# EAGLE design BT AQ DOL R8 (EAGLE 9.6.2)
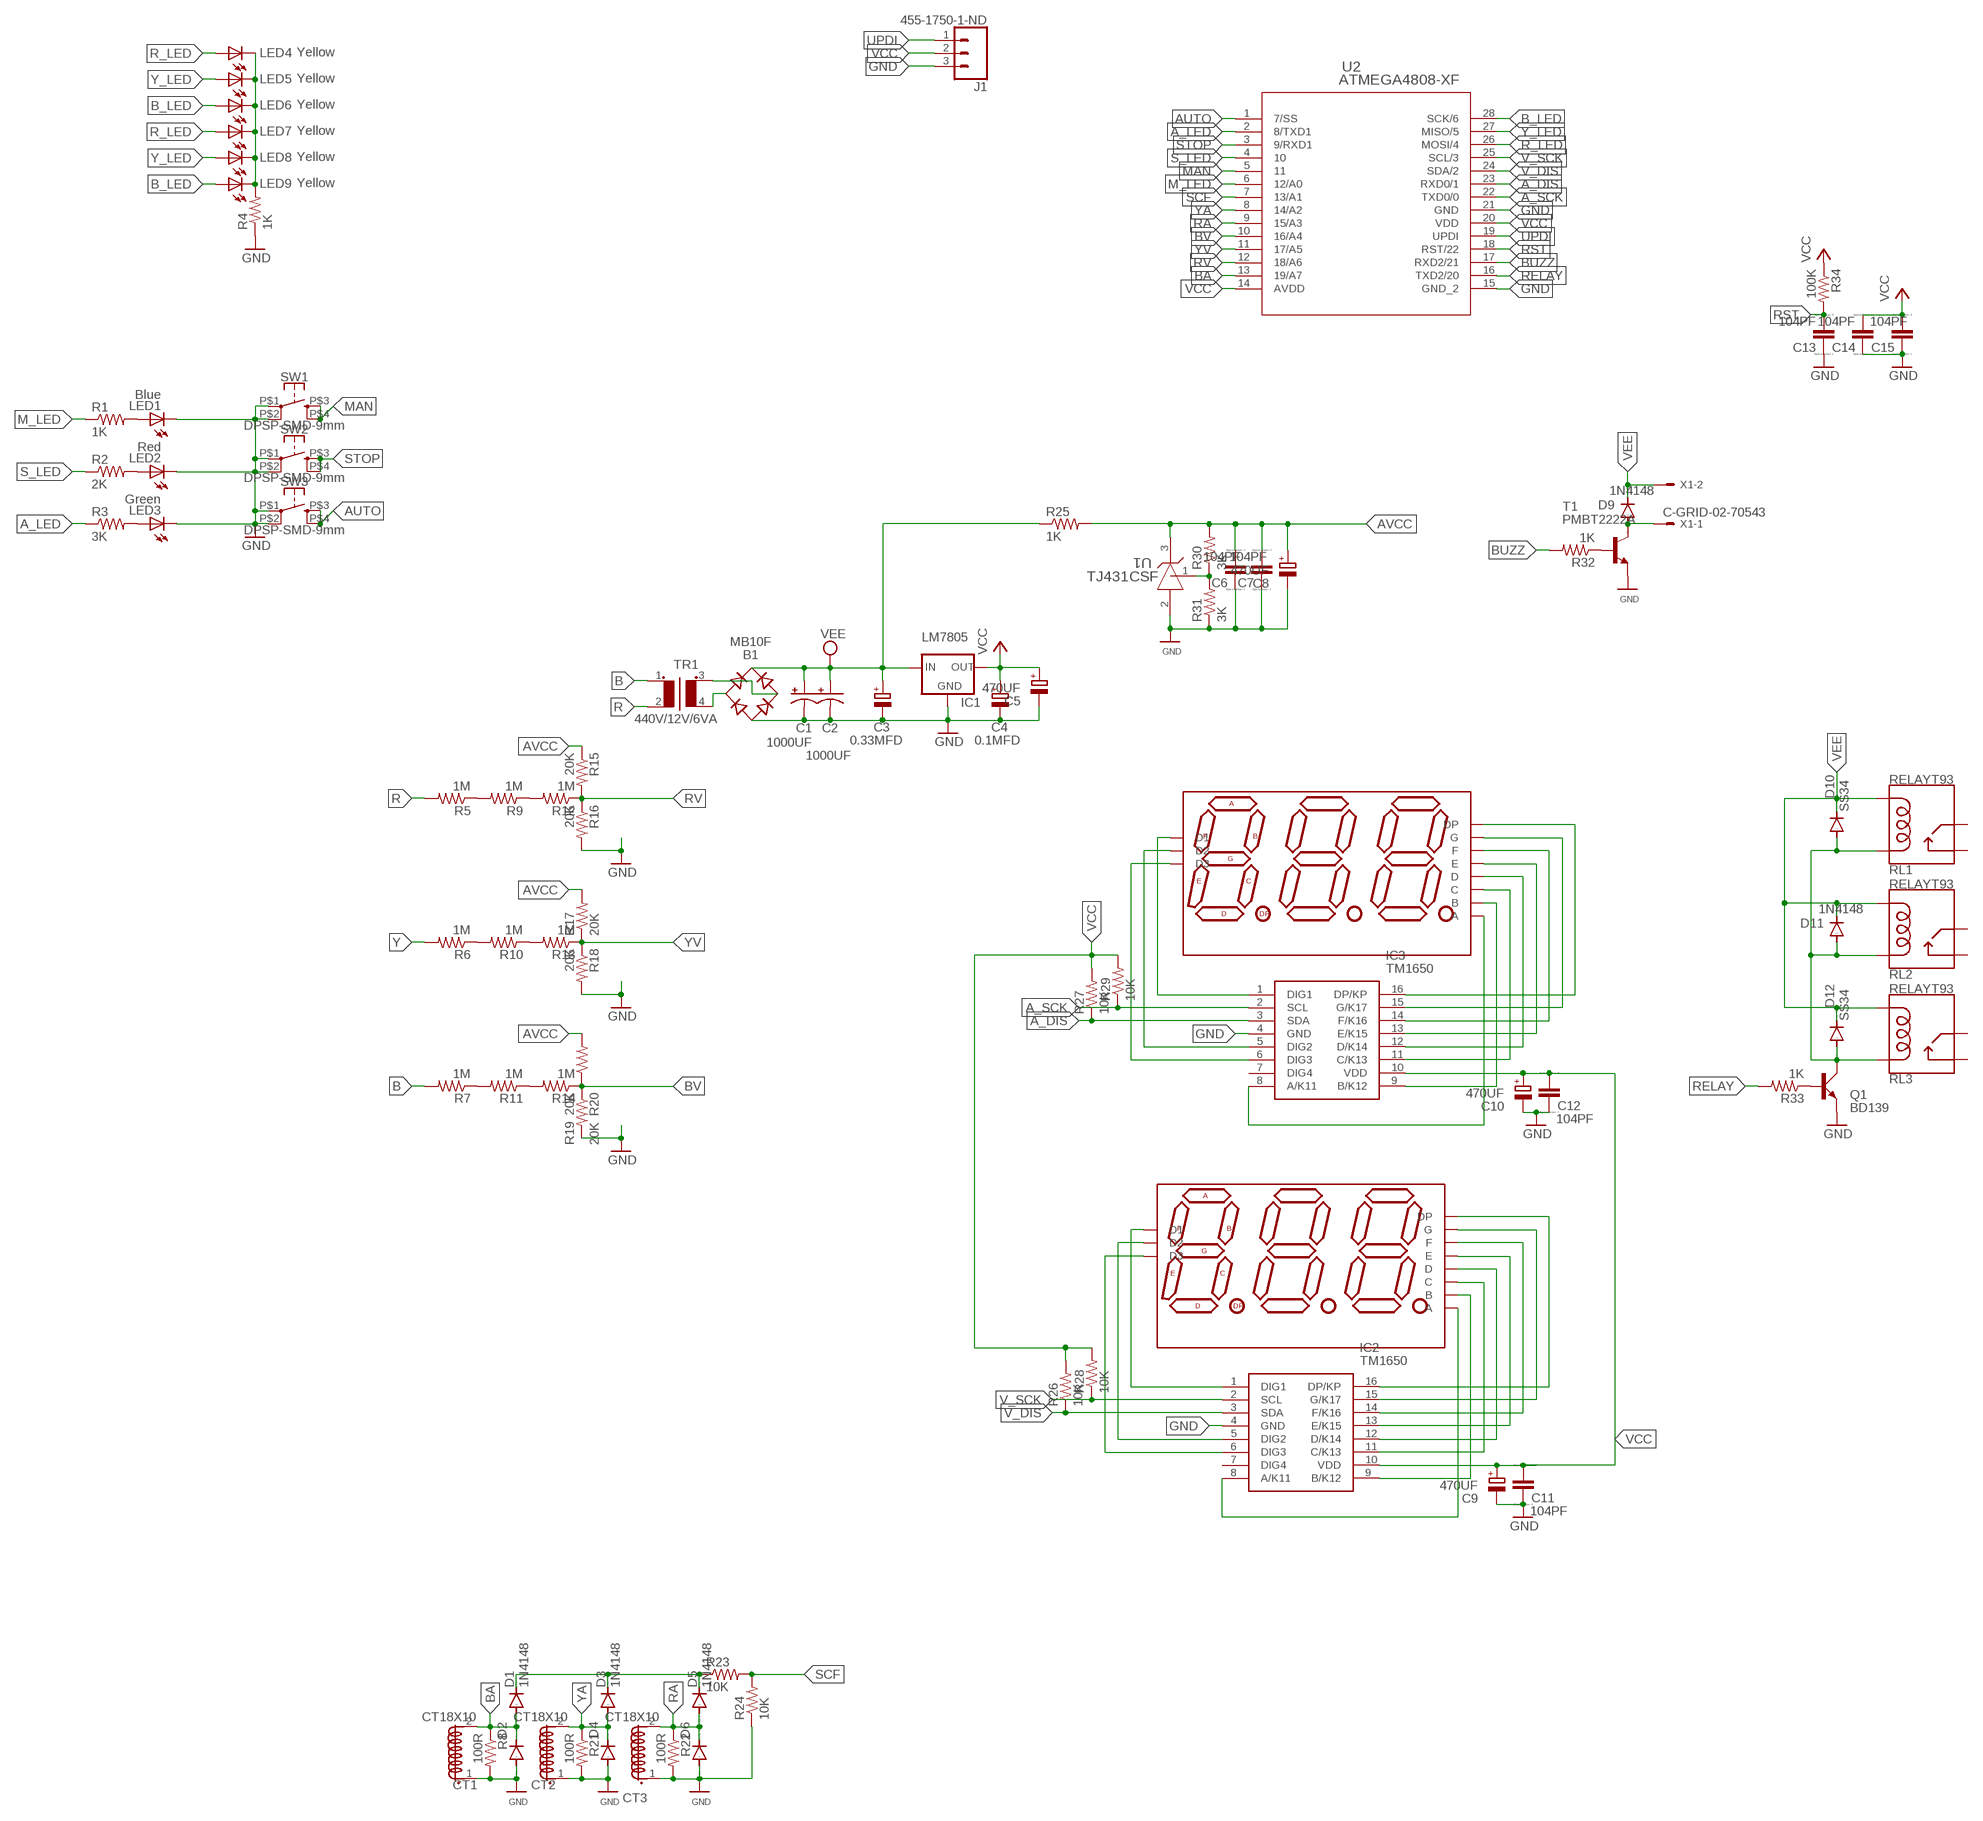
[diagram p0: schematic, sheet 1]

## Parts
B1  MB10F  MB8S  [SOIC-4]
C1  1000UF  CPOL-USE3.5-10  [E3,5-10]
C2  1000UF  CPOL-USE3.5-10  [E3,5-10]
C3  0.33MFD  CPOL-EUE2.5-5  [E2,5-5]
C4  0.1MFD  CPOL-EUE2.5-5  [E2,5-5]
C5  470UF  CPOL-EUE3.5-8  [E3,5-8]
C6  104PF  CC1206  [C1206]
C7  104PF  CC1206  [C1206]
C8  470UF  CPOL-EUE3.5-8  [E3,5-8]
C9  470UF  CPOL-EUE3.5-8  [E3,5-8]
C10  470UF  CPOL-EUE3.5-8  [E3,5-8]
C11  104PF  CC1206  [C1206]
C12  104PF  CC1206  [C1206]
C13  104PF  CC1206  [C1206]
C14  104PF  CC1206  [C1206]
C15  104PF  CC1206  [C1206]
CT1  CT18X10  [ZMCT103C]
CT2  CT18X10  [ZMCT103C]
CT3  CT18X10  [ZMCT103C]
D1  1N4148  DIODE-MINIMELF  [MINIMELF]
D2  SMAJ12A  DIODE-DO214AC  [DO214AC]
D3  1N4148  DIODE-MINIMELF  [MINIMELF]
D4  SMAJ12A  DIODE-DO214AC  [DO214AC]
D5  1N4148  DIODE-MINIMELF  [MINIMELF]
D6  SMAJ12A  DIODE-DO214AC  [DO214AC]
D7  SUNR036CC3D  7SEGMENT-3DIGITDIP  [7S3D036_DIP]
D8  SUNR036CC3D  7SEGMENT-3DIGITDIP  [7S3D036_DIP]
D9  1N4148  DIODE-MINIMELF  [MINIMELF]
D10  SS34  DIODE-DO-214AC  [DO-214AC]
D11  1N4148  DIODE-MINIMELF  [MINIMELF]
D12  SS34  DIODE-DO-214AC  [DO-214AC]
IC1  LM7805  78XXS  [78XXS]
IC2  TM1650  [SOIC127P604X185-16N]
IC3  TM1650  [SOIC127P604X185-16N]
J1  455-1750-1-ND  CONN_03  [1X03]
LED1  Blue  LED3MM  [LED3MM]
LED2  Red  LED3MM  [LED3MM]
LED3  Green  LED3MM  [LED3MM]
LED4  Yellow  LED3MM  [LED3MM]
LED5  Yellow  LED3MM  [LED3MM]
LED6  Yellow  LED3MM  [LED3MM]
LED7  Yellow  LED3MM  [LED3MM]
LED8  Yellow  LED3MM  [LED3MM]
LED9  Yellow  LED3MM  [LED3MM]
Q1  BD139  [TO126AV]
R1  1K  R-US_M1206  [M1206]
R2  2K  R-US_M1206  [M1206]
R3  3K  R-US_M1206  [M1206]
R4  1K  R-US_M1206  [M1206]
R5  1M  R-US_M1206  [M1206]
R6  1M  R-US_M1206  [M1206]
R7  1M  R-US_M1206  [M1206]
R8  100R  R-US_M1206  [M1206]
R9  1M  R-US_M1206  [M1206]
R10  1M  R-US_M1206  [M1206]
R11  1M  R-US_M1206  [M1206]
R12  1M  R-US_M1206  [M1206]
R13  1M  R-US_M1206  [M1206]
R14  1M  R-US_M1206  [M1206]
R15  20K  R-US_M1206  [M1206]
R16  20K  R-US_M1206  [M1206]
R17  20K  R-US_M1206  [M1206]
R18  20K  R-US_M1206  [M1206]
R19  20K  R-US_M1206  [M1206]
R20  20K  R-US_M1206  [M1206]
R21  100R  R-US_M1206  [M1206]
R22  100R  R-US_M1206  [M1206]
R23  10K  R-US_M1206  [M1206]
R24  10K  R-US_M1206  [M1206]
R25  1K  R-US_M1206  [M1206]
R26  10K  R-US_M1206  [M1206]
R27  10K  R-US_M1206  [M1206]
R28  10K  R-US_M1206  [M1206]
R29  10K  R-US_M1206  [M1206]
R30  3K  R-US_M1206  [M1206]
R31  3K  R-US_M1206  [M1206]
R32  1K  R-US_M1206  [M1206]
R33  1K  R-US_M1206  [M1206]
R34  100K  R-US_M1206  [M1206]
RL1  RELAYT93  [DT93]
RL2  RELAYT93  [DT93]
RL3  RELAYT93  [DT93]
SW1  DPSP-SMD-9mm  DPSP-SMD  [B3F-40XX-ROUND-SMD]
SW2  DPSP-SMD-9mm  DPSP-SMD  [B3F-40XX-ROUND-SMD]
SW3  DPSP-SMD-9mm  DPSP-SMD  [B3F-40XX-ROUND-SMD]
T1  PMBT2222A  MMUN2213LT1-NPN-SC59-BEC  [SC59-BEC]
TR1  440V/12V/6VA  TRANSFORMER6VA  [440V12V6VA]
U1  TJ431CSF  TJ431CSFDBZ0003A_L  [SOT-23]
U2  ATMEGA4808-XF  [SSOP28_SS_MCH]
X1  C-GRID-02-70543  [70543-02]

## Nets
A_DIS: IC3.3(SDA) R27.1 U2.23(RXD0/1)
A_LED: R3.1 U2.2(8/TXD1)
A_SCK: IC3.2(SCL) R29.1 U2.22(TXD0/0)
AUTO: SW3.P$3 SW3.P$4 U2.1(7/SS)
AVCC: C6.2 C7.2 C8.+ R15.1 R17.2 R19.2 R25.2 R30.2 U1.3(CATHODE)
B: R7.2 TR1.1
B_LED: LED6.A LED9.A U2.28(SCK/6)
BA: CT1.2(S1.2) D1.A D2.C R8.1 U2.13(19/A7)
BUZZ: R32.2 U2.17(RXD2/21)
BV: R14.1 R19.1 R20.1 U2.10(16/A4)
GND: B1.- C1.- C2.- C3.- C4.- C5.- C6.1 C7.1 C8.- C9.- C10.- C11.1 C12.1 C13.1 C14.1 C15.1 CT1.1(S1.1) CT2.1(S1.1) CT3.1(S1.1) D2.A D4.A D6.A IC1.GND IC2.4(GND) IC3.4(GND) J1.3 LED1.K(C) LED2.K(C) LED3.K(C) Q1.E R4.1 R8.2 R16.2 R18.2 R20.2 R21.2 R22.2 R24.1 R31.1 SW1.P$1 SW1.P$2 SW2.P$1 SW2.P$2 SW3.P$1 SW3.P$2 T1.E U1.2(ANODE) U2.15(GND_2) U2.21(GND)
M_LED: R1.1 U2.6(12/A0)
MAN: SW1.P$3 SW1.P$4 U2.5
N$1 [VEE]: B1.~2(AC2) TR1.3(S1)
N$2 [VEE]: B1.~1(AC1) TR1.4(S2)
N$3: D9.A T1.C X1.1
N$4: R32.1 T1.B
N$5: LED1.A R1.2
N$6: LED2.A R2.2
N$8: LED3.A R3.2
N$9: R30.1 R31.2 U1.1(REF)
N$10: LED4.K(C) LED5.K(C) LED6.K(C) LED7.K(C) LED8.K(C) LED9.K(C) R4.2
N$11: D1.C D3.C D5.C R23.1
N$13: R5.1 R9.2
N$14: R9.1 R12.2
N$15: R6.1 R10.2
N$18: R7.1 R11.2
N$19: R10.1 R13.2
N$22: Q1.B R33.1
N$23: R11.1 R14.2
N$28: D8.11(A) IC3.8(A/K11)
N$29: D8.7(B) IC3.9(B/K12)
N$30: D8.4(C) IC3.11(C/K13)
N$31: D8.2(D) IC3.12(D/K14)
N$32: D8.1(E) IC3.13(E/K15)
N$33: D8.10(F) IC3.14(F/K16)
N$34: D8.5(G) IC3.15(G/K17)
N$35: D8.3(DP) IC3.16(DP/KP)
N$36: D8.12(D1) IC3.1(DIG1)
N$37: D8.9(D2) IC3.5(DIG2)
N$38: D8.8(D3) IC3.6(DIG3)
N$39: D7.11(A) IC2.8(A/K11)
N$40: D7.7(B) IC2.9(B/K12)
N$41: D7.4(C) IC2.11(C/K13)
N$44: D7.2(D) IC2.12(D/K14)
N$48: D7.1(E) IC2.13(E/K15)
N$49: D7.10(F) IC2.14(F/K16)
N$50: D7.5(G) IC2.15(G/K17)
N$51: D7.3(DP) IC2.16(DP/KP)
N$52: D7.12(D1) IC2.1(DIG1)
N$53: D7.9(D2) IC2.5(DIG2)
N$54: D7.8(D3) IC2.6(DIG3)
N$121 [VEE]: D10.A D11.A D12.A Q1.C RL1.A1(COIL1) RL2.A1(COIL1) RL3.A1(COIL1)
R: R5.2 TR1.2
R_LED: LED4.A LED7.A U2.26(MOSI/4)
RA: CT3.2(S1.2) D5.A D6.C R22.1 U2.9(15/A3)
RELAY: R33.2 U2.16(TXD2/20)
RST: C13.2 R34.2 U2.18(RST/22)
RV: R12.1 R15.2 R16.1 U2.12(18/A6)
S_LED: R2.1 U2.4
SCF: R23.2 R24.2 U2.7(13/A1)
STOP: SW2.P$3 SW2.P$4 U2.3(9/RXD1)
UPDI: J1.1 U2.19(UPDI)
V_DIS: IC2.3(SDA) R26.1 U2.24(SDA/2)
V_SCK: IC2.2(SCL) R28.1 U2.25(SCL/3)
VCC: C4.+ C5.+ C9.+ C10.+ C11.2 C12.2 C14.2 C15.2 IC1.OUT IC2.10(VDD) IC3.10(VDD) J1.2 R26.2 R27.2 R28.2 R29.2 R34.1 U2.14(AVDD) U2.20(VDD)
VEE [VEE]: B1.+ C1.+ C2.+ C3.+ D9.C D10.C D11.C D12.C IC1.IN R25.1 RL1.A2(COIL2) RL2.A2(COIL2) RL3.A2(COIL2) X1.2
Y: R6.2
Y_LED: LED5.A LED8.A U2.27(MISO/5)
YA: CT2.2(S1.2) D3.A D4.C R21.1 U2.8(14/A2)
YV: R13.1 R17.1 R18.1 U2.11(17/A5)
Unconnected: IC2.7(DIG4) IC3.7(DIG4) RL1.11(MAIN) RL1.14(N0) RL2.11(MAIN) RL2.14(N0) RL3.11(MAIN) RL3.14(N0)

## Library data of the parts
B1 = rectifier:MB*S: Bridge Rectifier Source: http://www.fairchildsemi.com/ds/MB/MB6S.pdf
C1 C2 = rcl:CPOL-US: POLARIZED CAPACITOR, American symbol; SPICEPREFIX: C
C3-C5 C8-C10 = rcl:CPOL-EU: POLARIZED CAPACITOR, European symbol; SPICEPREFIX: C
C6 C7 C11-C15 = eagle-ltspice:C: CAPACITOR, European symbol; SPICEMODEL: NONE; SPICEPREFIX: C
CT1-CT3 = User Components:CT
D1-D6 D9-D12 = diode:DIODE-: DIODE
D7 D8 = User Components:7SEGMENT-3DIGIT
IC1 = v-reg:78XXS: VOLTAGE REGULATOR
IC2 IC3 = User Components:TM1650: The TM1650 is a dedicated LED (LED display) drive control circuit with a keyboard scan interface. The MCU input and output control digital interface, data latch, LED driver, keyboard scan, brightness adjustment and other circuits are integrated inside. The TM1650's stable performance, reliable quality, and high immunity to interference make it suitable for long-term continuous operation in 24 hours Source: Datasheet <http://www.titanmec.com/index.php/en/product/download/id/540.html>; DESCRIPTION: The TM1650 is a dedicated LED (LED display) drive control circuit with a keyboard scan interface. The MCU input and output control digital interface, data latch, LED driver, keyboard scan, brightness adjustment and other circuits are integrated inside. The TM1650's stable performance, reliable quality, and high immunity to interference make it suitable for long-term continuous operation in 24 hours; HEIGHT: 1.85mm; MANUFACTURER_NAME: TITAN MICRO ELECTRONICS; MANUFACTURER_PART_NUMBER: tm1650
J1 = SparkFun-Connectors:CONN_03: Multi connection point. Often used as Generic Header-pin footprint for 0.1 inch spaced/style header connections On any of the 0.1 inch spaced packages, you can populate with these: Break Away Headers - Straight <https://www.sparkfun.com/products/116> (PRT-00116) Break Away Male Headers - Right Angle <https://www.sparkfun.com/products/553> (PRT-00553) Female Headers <https://www.sparkfun.com/products/115> (PRT-00115) Break Away Headers - Machine Pin <https://www.sparkfun.com/products/117> (PRT-00117) Break Away Female Headers - Swiss Machine Pin <https://www.sparkfun.com/products/743> (PRT-00743) Stackable Header - 3 Pin (Female, 0.1") <https://www.sparkfun.com/products/13875> (PRT-13875) For SCREWTERMINALS and SPRING TERMINALS visit here: Screw Terimnals on SparkFun.com <https://www.sparkfun.com/search/results?term=Screw+Terminals> (5mm/3.5mm/2.54mm spacing) This device is also useful as a general connection point to wire up your design to another part of your project. Our various solder wires solder well into these plated through hole pads. Hook-Up Wire - Assortment (Stranded, 22 AWG) <https://www.sparkfun.com/products/11375> (PRT-11375) Hook-Up Wire - Assortment (Solid Core, 22 AWG) <https://www.sparkfun.com/products/11367> (PRT-11367) View the entire wire category on our website here <https://www.sparkfun.com/categories/141> Special notes: Molex polarized connector foot print use with SKU : PRT-08232 with associated crimp pins and housings.; PROD_ID: XXX-00000
LED1-LED9 = adafruit:LED: LED OSRAM: - CHIPLED LG R971, LG N971, LY N971, LG Q971, LY Q971, LO R971, LY R971 LH N974, LH R974 LS Q976, LO Q976, LY Q976 LO Q996 - Hyper CHIPLED LW Q18S LB Q993, LB Q99A, LB R99A - SideLED LS A670, LO A670, LY A670, LG A670, LP A670 LB A673, LV A673, LT A673, LW A673 LH A674 LY A675 LS A676, LA A676, LO A676, LY A676, LW A676 LS A679, LY A679, LG A679 - Hyper Micro SIDELED® LS Y876, LA Y876, LO Y876, LY Y876 LT Y87S - SmartLED LW L88C, LW L88S LB L89C, LB L89S, LG L890 LS L89K, LO L89K, LY L89K LS L896, LA L896, LO L896, LY L896 - TOPLED LS T670, LO T670, LY T670, LG T670, LP T670 LSG T670, LSP T670, LSY T670, LOP T670, LYG T670 LG T671, LOG T671, LSG T671 LB T673, LV T673, LT T673, LW T673 LH T674 LS T676, LA T676, LO T676, LY T676, LB T676, LH T676, LSB T676, LW T676 LB T67C, LV T67C, LT T67C, LS T67K, LO T67K, LY T67K, LW E67C LS E67B, LA E67B, LO E67B, LY E67B, LB E67C, LV E67C, LT E67C LW T67C LS T679, LY T679, LG T679 LS T770, LO T770, LY T770, LG T770, LP T770 LB T773, LV T773, LT T773, LW T773 LH T774 LS E675, LA E675, LY E675, LS T675 LS T776, LA T776, LO T776, LY T776, LB T776 LHGB T686 LT T68C, LB T68C - Hyper Mini TOPLED® LB M676 - Mini TOPLED Santana® LG M470 LS M47K, LO M47K, LY M47K Source: http://www.osram.convergy.de/
Q1 = transistor-power:BD139: NPN TRANSISTOR
R1-R7 R9-R20 R26-R29 R32-R34 = rcl:R-US_: RESISTOR, American symbol; SPICEPREFIX: R
R8 R21-R25 R30 R31 = rcl:R-US_: RESISTOR, American symbol
RL1-RL3 = User Components:RELAY
SW1-SW3 = User Components:DPSP-SMD
T1 = transistor:*-NPN-: NPN Transistror BF959 corrected 2008.03.06
TR1 = User Components:TRANSFORMER
U1 = User Components:TJ431CSF; COPYRIGHT: Copyright (C) 2022 Ultra Librarian. All rights reserved.; MANUFACTURER_PART_NUMBER: TL431IDBZTG4; MFR_NAME: Texas Instruments; REFDES: RefDes; TYPE: TYPE
U2 = User Components:ATMEGA4808-XF; COPYRIGHT: Copyright (C) 2022 Ultra Librarian. All rights reserved.; MANUFACTURER_PART_NUMBER: ATMEGA4808-XF; MFR_NAME: Microchip
X1 = con-molex:C-GRID-02: CONNECTOR wire to board 2.54 mm (0.100") pitch header; MF: MOLEX; OC_FARNELL: unknown; OC_NEWARK: unknown

## Net classes
0 default: width 0.254 mm, drill 0.508 mm, clearance 0.508 mm
1 VEE: width 0.762 mm, drill 0.508 mm, clearance 0.762 mm

## Board
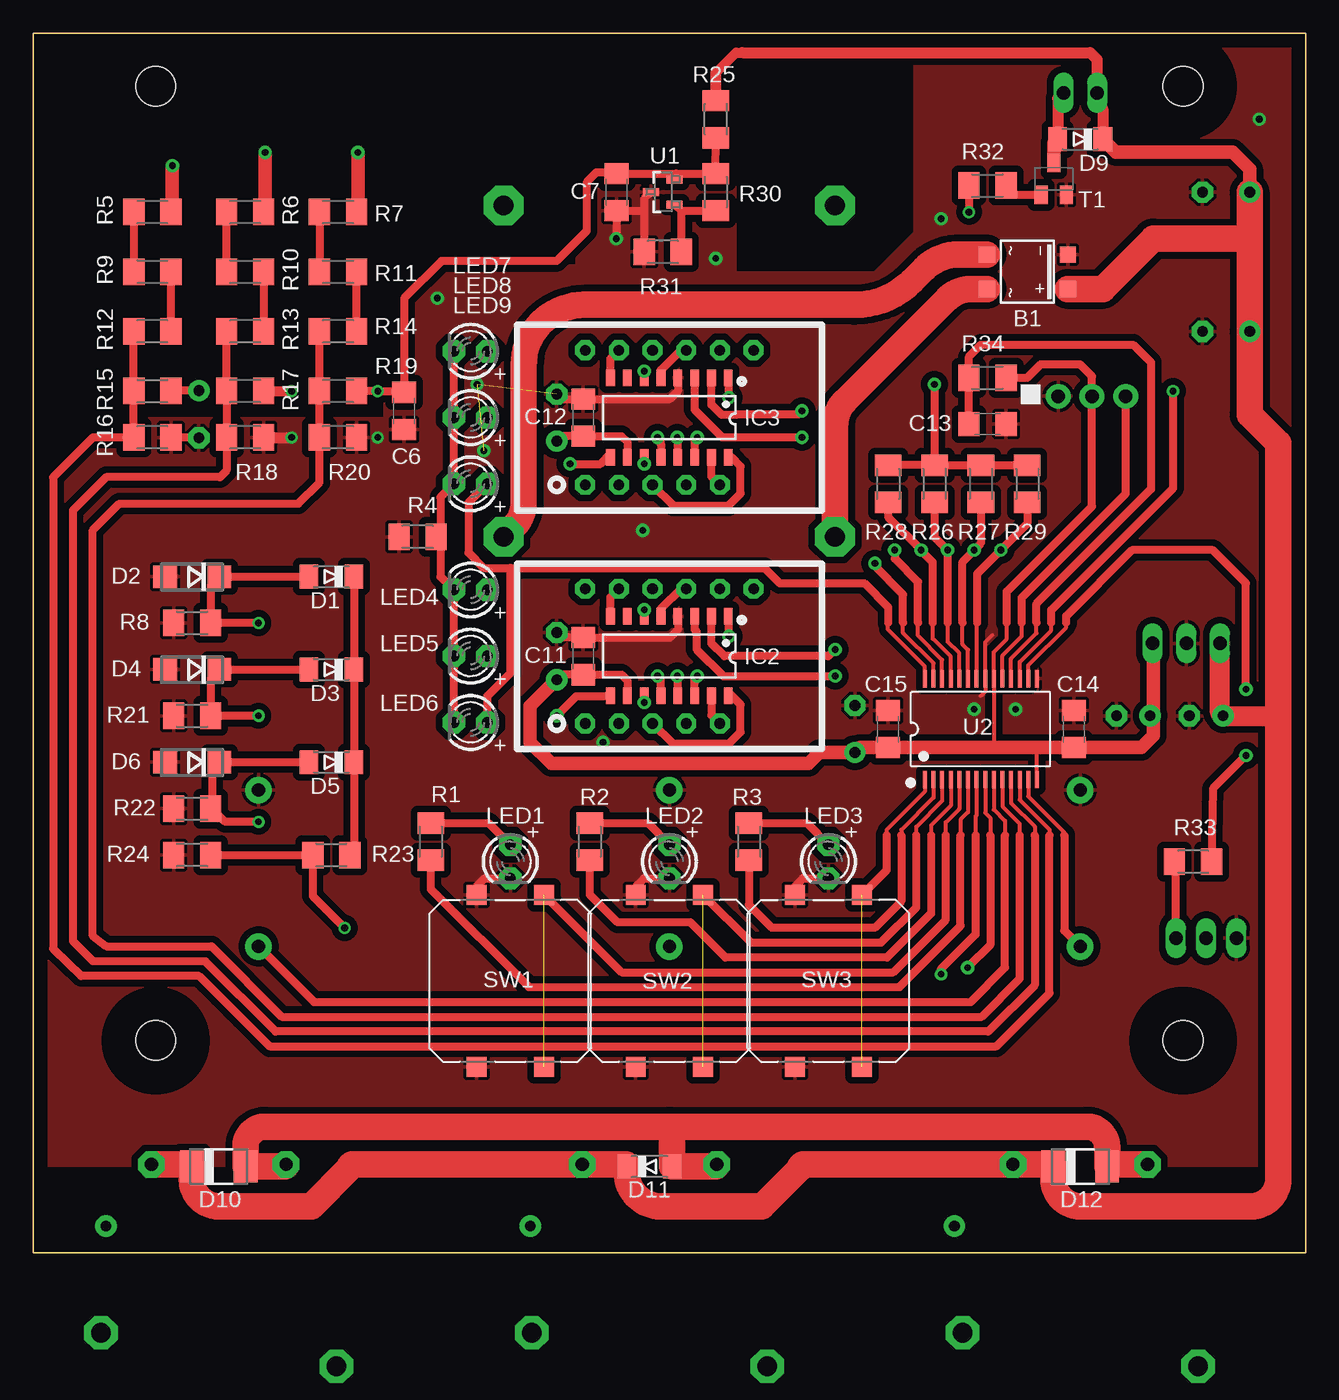
[diagram p1: board, top side]
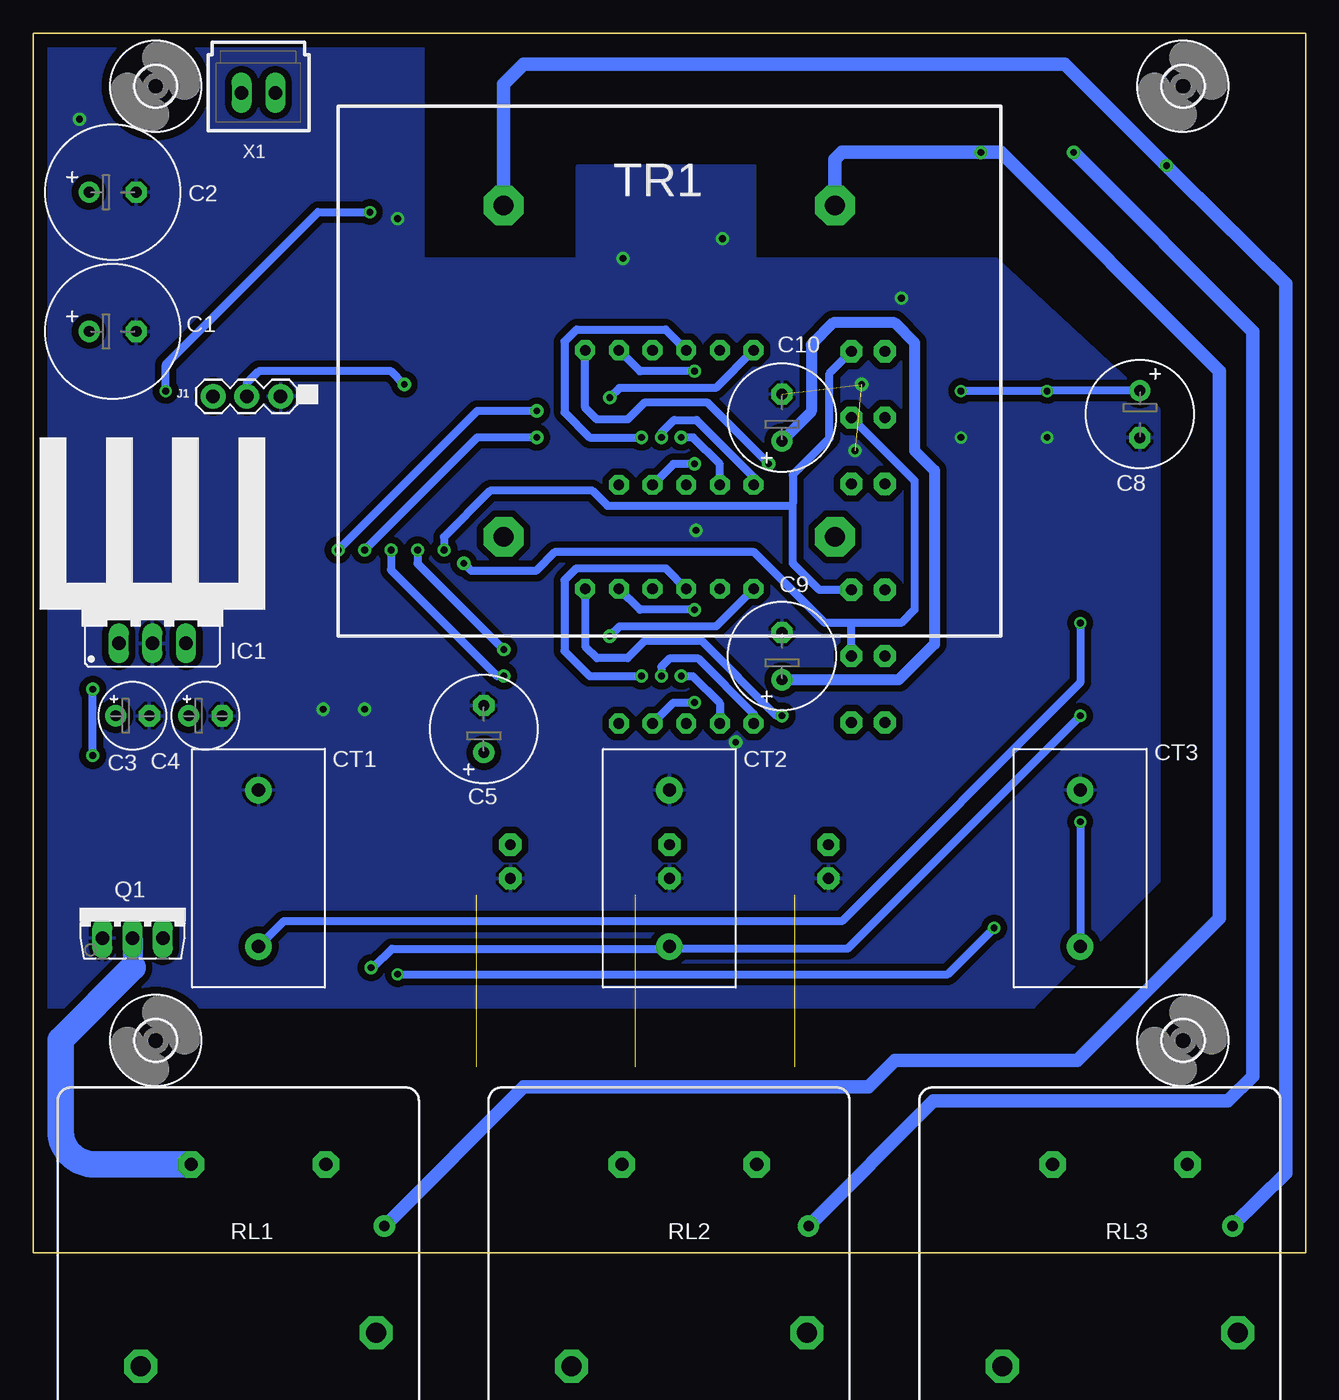
[diagram p2: board, bottom side, seen from below]

Size 96 x 92 mm. Coordinates in mm from the lower left corner, seen from the top.
Outline: 96,0 96,92 0,92 0,0 96,0
Copper layers (1*16): Top 0.035mm / dielectric 1.5mm / Bottom 0.035mm
Design rules "default *": minimum track width 6mil, minimum drill 0.35mm, track to track 6mil, track to pad 6mil, pad to pad 6mil, via to via 6mil, smd to smd 6mil, copper to edge 40mil, drill to drill 6mil, minimum pad ring 10mil, minimum via ring 8mil, stop-mask expansion 4mil, vias tented up to drill 20mil, thermal gap 10mil

### Footprints (pad centres in the part's own frame; a part is rotated, then mirrored left to right if it is on the bottom)
SOIC-4 = smd 1.2 x 1.2: + 1.3,3.05; - -1.3,3.05; ~1 -1.3,-3.05; ~2 1.3,-3.05
E3,5-10 = drill 0.813 pad 1.6: + -1.778,0 | drill 0.813 pad 1.6 octagon: - 1.778,0
E2,5-5 = drill 0.813 pad 1.6: + -1.27,0 | drill 0.813 pad 1.6 octagon: - 1.27,0
E3,5-8 = drill 0.813 pad 1.6: + -1.778,0 | drill 0.813 pad 1.6 octagon: - 1.778,0
C1206 = smd 1.6 x 1.8: 1 -1.4,0; 2 1.4,0
ZMCT103C = drill 1 pad 2: 1 -5.9,0; 2 5.9,0
MINIMELF = smd 1.4 x 1.8: A 1.7,0; C -1.7,0
DO214AC = smd 1.8 x 1.7: A 2.05,0; C -2.05,0
7S3D036_DIP = drill 0.8 pad 1.5 octagon: 1 -6.35,-5.08; 2 -3.81,-5.08; 3 -1.27,-5.08; 4 1.27,-5.08; 5 3.81,-5.08; 7 6.35,5.08; 8 3.81,5.08; 9 1.27,5.08; 10 -1.27,5.08; 11 -3.81,5.08; 12 -6.35,5.08
DO-214AC = smd 1.8 x 2.4: A 2.025,0; C -2.025,0
78XXS = drill 1.016 long: GND 0,-2.54; IN -2.54,-2.54; OUT 2.54,-2.54
SOIC127P604X185-16N = smd 1.25 x 0.65: 1 -3,4.445; 2 -3,3.175; 3 -3,1.905; 4 -3,0.635; 5 -3,-0.635; 6 -3,-1.905; 7 -3,-3.175; 8 -3,-4.445; 9 3,-4.445; 10 3,-3.175; 11 3,-1.905; 12 3,-0.635; 13 3,0.635; 14 3,1.905; 15 3,3.175; 16 3,4.445
1X03 = drill 1.016 pad 1.88: 1 0,0; 2 2.54,0; 3 5.08,0
LED3MM = drill 0.813 pad 1.676 octagon: A -1.27,0; K 1.27,0
TO126AV = drill 1.016 long: B 2.286,-1.27; C 0,-1.27; E -2.286,-1.27
M1206 = smd 1.6 x 2: 1 -1.4,0; 2 1.4,0
DT93 = drill 1.5 pad 2.5 octagon: 11 -2.54,-8.88; 14 -5.08,8.88 | drill 1 pad 2 octagon: A1 10.16,5.08; A2 10.16,-5.08
B3F-40XX-ROUND-SMD = smd 1.5 x 1.5: P$1 -6.5,2.54; P$2 6.5,2.54; P$3 -6.5,-2.54; P$4 6.5,-2.54
SC59-BEC = smd 1 x 1.4: B -0.95,-1.2; C 0,1.2; E 0.95,-1.2
440V12V6VA = drill 1.5 pad 3 octagon: 1 -12.5,12.5; 2 -12.5,-12.5; 3 12.5,-12.5; 4 12.5,12.5
SOT-23 = smd 0.6 x 1.2: 1 -0.95,-0.9; 2 0,0.9; 3 0.95,-0.9
SSOP28_SS_MCH = smd 1.3 x 0.3: 1 -3.8,4.225; 2 -3.8,3.575; 3 -3.8,2.925; 4 -3.8,2.275; 5 -3.8,1.625; 6 -3.8,0.975; 7 -3.8,0.325; 8 -3.8,-0.325; 9 -3.8,-0.975; 10 -3.8,-1.625; 11 -3.8,-2.275; 12 -3.8,-2.925; 13 -3.8,-3.575; 14 -3.8,-4.225; 15 3.8,-4.225; 16 3.8,-3.575; 17 3.8,-2.925; 18 3.8,-2.275; 19 3.8,-1.625; 20 3.8,-0.975; 21 3.8,-0.325; 22 3.8,0.325; 23 3.8,0.975; 24 3.8,1.625; 25 3.8,2.275; 26 3.8,2.925; 27 3.8,3.575; 28 3.8,4.225
3,0 = hole 3: 0,0
70543-02 = drill 1.016 long: 1 -1.27,0; 2 1.27,0

### Placement (x,y rotation side)
B1  75,74 270 top
C1  90,69.5 0 bottom
C2  90,80 0 bottom
C3  88.5,40.5 0 bottom
C4  83,40.5 0 bottom
C5  62,39.5 90 bottom
C6  28,63.5 90 top
C7  44,80 90 top
C8  12.5,63.25 270 bottom
C9  39.5,45 90 bottom
C10  39.5,63 90 bottom
C11  41.5,45 270 top
C12  41.5,63 270 top
C13  72,62.5 180 top
C14  78.5,39.5 270 top
C15  64.5,39.5 270 top
CT1  79,29 270 bottom
CT2  48,29 270 bottom
CT3  17,29 270 bottom
D1  22.5,51 180 top
D2  12,51 180 top
D3  22.5,44 180 top
D4  12,44 180 top
D5  22.5,37 180 top
D6  12,37 180 top
D7  48,45 0 top
D8  48,63 0 top
D9  79,84 180 top
D10  14,6.5 0 top
D11  46.5,6.5 0 top
D12  79,6.5 0 top
IC1  87,48.5 0 bottom
IC2  48,45 270 top
IC3  48,63 270 top
J1  82.42,64.6 0 bottom
LED1  36,29.5 270 top
LED2  48,29.5 270 top
LED3  60,29.5 270 top
LED4  33,50 180 top
LED5  33,45 180 top
LED6  33,40 180 top
LED7  33,68 180 top
LED8  33,63 180 top
LED9  33,58 180 top
Q1  88.5,25 0 bottom
R1  30,31 90 top
R2  42,31 90 top
R3  54,31 90 top
R4  29,54 0 top
R5  9,78.5 0 top
R6  16,78.5 0 top
R7  23,78.5 0 top
R8  12,47.5 180 top
R9  9,74 180 top
R10  16,74 180 top
R11  23,74 180 top
R12  9,69.5 0 top
R13  16,69.5 0 top
R14  23,69.5 0 top
R15  9,65 180 top
R16  9,61.5 0 top
R17  16,65 0 top
R18  16,61.5 0 top
R19  23,65 0 top
R20  23,61.5 0 top
R21  12,40.5 180 top
R22  12,33.5 180 top
R23  22.5,30 180 top
R24  12,30 0 top
R25  51.5,85.5 270 top
R26  68,58 90 top
R27  71.5,58 90 top
R28  64.5,58 90 top
R29  75,58 90 top
R30  51.5,80 90 top
R31  47.5,75.5 0 top
R32  72,80.5 180 top
R33  87.5,29.5 0 top
R34  72,66 180 top
RL1  79,-3.5 90 bottom
RL2  46.5,-3.5 90 bottom
RL3  14,-3.5 90 bottom
SW1  36,20.5 90 top
SW2  48,20.5 90 top
SW3  60,20.5 90 top
T1  77,81 0 top
TR1  48,66.5 270 bottom
U1  47.5,80 90 top
U2  71.5,39.5 90 top
U$1  [3,0]  86.75,16 0 bottom
U$2  [3,0]  9.25,16 0 bottom
U$3  [3,0]  86.75,88 0 bottom
U$4  [TO220_17X13]  87,55 0 bottom
U$8  [3,0]  9.25,88 0 bottom
X1  79,87.5 180 bottom

### Tracks (layer width: path | path; a pad name or v marks a point on that pad's centre or on a via)
A_DIS  (via drill 0.51 pad 1)
  Top 0.305: 70.11,47.5 70.11,45.88 70.53,45.47 U2.23
  Top 0.61: IC3.3 49.91,63.59 52,61.5 v58,61.5 | 70.11,47.5 70.11,52.11 v71,53 71.5,53.5 R27.1
  Bottom 0.61: v58,61.5 62.5,61.5 v71,53
A_LED
  Top 0.305: 65.5,31.5 65.5,31.9 67.92,34.32 U2.2
  Top 0.61: R3.1 54,26.24 55.74,24.5 63.5,24.5 65.5,26.5 65.5,31.5
A_SCK  (via drill 0.51 pad 1)
  Top 0.305: 71.22,47.5 71.17,47.45 U2.22
  Top 0.61: R29.1 75,55 v73,53 71.22,51.22 71.22,47.5 | v58,63.5 57.73,63.23 53.09,63.23 53.04,63.19 51.96,63.19 51.17,63.97 IC3.2
  Bottom 0.61: v58,63.5 62.5,63.5 v73,53
AUTO  (1 unrouted)
  Top 0.305: 64.38,31.5 64.38,31.88 67.28,34.77 U2.1
  Top 0.61: SW3.P$4 64.38,28.84 64.38,31.5
AVCC  (via drill 0.51)
  Top 0.61: 48.5,81.4 C7.2 43.9,81.5 42.5,81.5 41.75,80.75 41.75,77.06 39.5,74.81 30.81,74.81 28,72 C6.2 27.9,65 v26,65 R19.2 | 48.5,81.4 51.4,81.4 | 51.4,81.4 R30.2 | U1.3 48.5,81.05 48.5,81.4 | R25.2 51.4,81.4 | C8.+ 10.43,65.03 R15.1
  Top 0.762: R17.2 v19.5,65
  Bottom 0.61: C8.+ 19.47,65.03 v19.5,65 v26,65
B  (via drill 0.51 pad 1, 0.8 pad 1.6)
  Top 0.61: 24.5,78.6 R7.2
  Top 1: v24.5,83 24.5,78.6
  Bottom 1: v69.5,2 59,12.5 33,12.5 31,14.5 17.2,14.5 6.5,25.2 6.5,66.5 23,83 v24.5,83 35,83 35.5,82.5 TR1.1
B_LED
  Top 0.305: 64.52,47.5 64.5,47.48 64.5,47 67.28,44.23 U2.28
  Top 0.61: 64.52,47.5 64.52,48.68 62.7,50.5 56.31,50.5 55.16,51.65 36,51.65 | LED6.A 34.27,42 36,43.73 36,51.65 | LED9.A 32.85,56.58 32.85,52.8 34,51.65 36,51.65
BA  (via drill 0.51)
  Top 0.305: 77.79,31.5 77.79,31.7 75.08,34.41 U2.13
  Top 0.61: CT1.2 77.79,24.31 77.79,31.5 | D1.A D2.C 13.4,50.35 R8.1 v17,47.5
  Bottom 0.61: v17,47.5 17,43 35,25 77.1,25 CT1.2
BUZZ  (via drill 0.51)
  Top 0.305: 76.81,47.5 76.81,46.95 74.42,44.56 U2.17
  Top 0.61: 76.81,47.5 76.81,48.49 86,57.68 v86,65 | R32.2 v70.6,78.5
  Bottom 0.61: v86,65 86,67 74.5,78.5 v70.6,78.5
BV
  Top 0.305: 74.44,31.5 74.44,32.35 73.12,33.67 U2.10
  Top 0.61: R14.1 R19.1 R20.1 21.6,58.1 20,56.5 6.5,56.5 4.5,54.5 4.5,23.89 5.51,23.1 13.45,23.1 18.76,17.8 71.56,17.8 74.44,20.68 74.44,31.5
GND  (via drill 0.51, 0.51 pad 1)  (2 unrouted)
  Top 0.305: 72.34,46.57 71.83,46.05 U2.21 71.83,42.33 71.5,42
  Top 0.61: C10.- 39.88,64.4 C12.1 48.03,64.4 48.63,65 IC3.4 | 57.46,27.62 58.07,28.23 LED3.K | 45.46,27.62 46.07,28.23 LED2.K | 33.46,27.62 34.07,28.23 LED1.K | U1.2 46.1,79.5 46.1,78.5 | 46.1,78.5 R31.1 | 46.1,78.5 46,78.6 C7.1 v44,76.5 | IC2.4 48.63,47 48.03,46.4 C11.1 39.88,46.4 C9.- | 10.5,47 10.6,47.1 R8.2 | C8.- 10.43,61.47 R16.2
  Top 0.813: C14.1 78.4,41 | R18.2 v19.5,61.5
  other vias: 71,41 74.13,41 68.5,78 26,61.5 43,38.5 33.5,65.5 34,60.5 46,54.5 92.5,85.5 51.5,75 30.5,72
  pour Top: 96,6.5 0,6.5 0,63 26.5,63 26.5,74.5 41,74.5 41,86.5 53,86.5 53,74.02 63.46,73.96 66.5,77 66.5,92 96,92
  pour Bottom: 96,92 96,18.5 20.5,18.5 11,28 11,63.62 23.28,75 41.5,75 41.5,82 55,82 55,75 66.5,75 66.5,92
M_LED
  Top 0.305: 69.97,31.5 69.97,32.67 70.53,33.23 U2.6
  Top 0.61: R1.1 30,27.43 37.4,20.03 65.36,20.03 69.97,24.65 69.97,31.5
MAN  (1 unrouted)
  Top 0.305: 68.85,31.5 68.85,32.45 69.88,33.48 U2.5
  Top 0.61: SW1.P$4 44.39,21.15 64.89,21.15 68.85,25.11 68.85,31.5
N$1
  Top 2: B1.~2 70.75,72.7 arc45 68.96,71.96 61.24,64.24 arc45 60.5,62.45 TR1.3
N$2
  Top 2: B1.~1 69.82,75.3 arc45 67.23,74.23 66.31,73.31 arc-45 61.95,71.5 41.55,71.5 arc45 38.33,70.17 arc45 37,66.95 37,56.55 arc-45 36.26,54.76 TR1.4
N$3
  Top 0.813: X1.1 77.3,87.07 D9.A
  Top 1: T1.C 77,83.7 D9.A
N$4
  Top 0.61: R32.1 74.1,79.8 T1.B
N$5
  Top 0.61: R1.2 34.37,32.4 LED1.A
N$6
  Top 0.61: R2.2 46.37,32.4 LED2.A
N$8
  Top 0.61: R3.2 58.37,32.4 LED3.A
N$9
  Top 0.61: R31.2 48.9,78.55 | 48.9,78.55 U1.1 | R30.1 51.45,78.55 48.9,78.55
N$10
  Top 0.61: LED7.K LED8.K LED9.K 30.73,57 30.73,54 | 30.73,54 30.73,51 LED4.K LED5.K LED6.K | R4.2 30.73,54
N$11
  Top 0.61: D1.C D3.C D5.C 24.2,30.3 R23.1
N$13
  Top 0.61: R5.1 R9.2
N$14
  Top 0.61: R12.2 R9.1
N$15
  Top 0.61: R10.2 R6.1
N$18
  Top 0.61: R7.1 R11.2
N$19
  Top 0.61: R10.1 R13.2
N$22
  Top 0.61: R33.1 86.21,29.39 Q1.B
N$23
  Top 0.61: R14.2 R11.1
N$28
  Top 0.61: IC3.8 43.55,67.44 D8.11
N$29  (via drill 0.51 pad 1)
  Top 0.61: v40.5,59.5 42.79,59.5 43.55,60.27 IC3.9
  Bottom 0.61: D8.7 54.35,63.73 53.47,62.86 51.14,62.86 49.88,64.12 45.12,64.12 v40.5,59.5
N$30  (via drill 0.51 pad 1)
  Top 0.61: IC3.11 v46.1,59.5
  Bottom 0.61: v46.1,59.5 47.69,59.5 D8.4
N$31  (via drill 0.51 pad 1)
  Top 0.61: v47.1,61.5 47.36,61.14 47.36,61.03 47.37,61.02 IC3.12
  Bottom 0.61: D8.2 44.19,59.48 46.21,61.5 v47.1,61.5
N$32  (via drill 0.51 pad 1)
  Top 0.61: v48.6,61.5 48.63,61.37 IC3.13
  Bottom 0.61: D8.1 41.65,58.52 45.94,62.81 47.64,62.81 48.6,61.86 v48.6,61.5
N$33  (via drill 0.51 pad 1)
  Top 0.61: v50.1,61.5 49.91,61.41 IC3.14
  Bottom 0.61: v50.1,61.5 54.02,61.5 55.91,63.4 55.91,68.73 55,69.64 48.29,69.64 D8.10
N$34
  Top 0.61: D8.5 51.17,58.55 IC3.15
N$35
  Top 0.61: D8.3 48.29,56.36 52.46,56.36 53.37,57.27 53.37,59.34 52.71,60 IC3.16
N$36  (via drill 0.51 pad 1)
  Top 0.61: v52.5,64.5 52.45,64.56 52.45,65.73 IC3.1
  Bottom 0.61: v52.5,64.5 51.77,65.23 44.5,65.23 D8.12
N$37
  Top 0.61: D8.9 48.87,68.08 47.37,66.58 IC3.5
N$38  (via drill 0.51 pad 1)
  Top 0.61: IC3.6 v46.09,66.5 v46.1,66.5
  Bottom 0.61: v46.1,66.5 50.23,66.5 D8.8
N$39
  Top 0.61: IC2.8 43.55,49.45 D7.11
N$40  (via drill 0.51 pad 1)
  Top 0.61: v39.5,40.5 40.99,41.99 43.28,41.99 43.55,42.27 IC2.9
  Bottom 0.61: v39.5,40.5 39.92,40.5 45.55,46.13 49.87,46.13 51.14,44.86 53.47,44.86 54.35,45.73 D7.7
N$41  (via drill 0.51 pad 1)
  Top 0.61: IC2.11 46.09,41.59 v46.1,41.5
  Bottom 0.61: D7.4 47.69,41.5 v46.1,41.5
N$44  (via drill 0.51 pad 1)
  Top 0.61: IC2.12 47.37,43.23 v47.1,43.5
  Bottom 0.61: v47.1,43.5 46.24,43.5 44.19,41.45 D7.2
N$48  (via drill 0.51 pad 1)
  Top 0.61: IC2.13 48.63,43.37 v48.6,43.5
  Bottom 0.61: D7.1 41.65,40.65 45.81,44.81 48,44.81 48.6,44.21 v48.6,43.5
N$49  (via drill 0.51 pad 1)
  Top 0.61: v50.1,43.5 49.91,43.41 49.91,43 49.91,42.27 IC2.14
  Bottom 0.61: v50.1,43.5 54.02,43.5 55.91,45.4 55.91,50.73 55,51.64 48.29,51.64 D7.10
N$50
  Top 0.61: IC2.15 51.17,40.55 D7.5
N$51
  Top 0.61: D7.3 48.29,38.36 52.46,38.36 53.37,39.27 53.37,41.34 52.45,42.27 IC2.16
N$52  (via drill 0.51 pad 1)
  Top 0.61: v52.5,46.5 52.45,46.55 52.45,47.5 52.45,47.73 IC2.1
  Bottom 0.61: v52.5,46.5 51.75,47.25 44.48,47.25 D7.12
N$53
  Top 0.61: IC2.5 47.37,48.58 48.87,50.08 D7.9
N$54  (via drill 0.51 pad 1)
  Top 0.61: IC2.6 v46.09,48.49 v46.1,48.5
  Bottom 0.61: v46.1,48.5 50.23,48.5 D7.8
N$121
  Top 2: 48,9.5 17.5,9.5 arc90 16.02,8.03 D10.A 18.92,6.5 arc90 RL3.A1 | 48,9.5 79.48,9.5 arc-90 81.03,7.96 D12.A arc-90 81.19,6.66 RL1.A1 | RL2.A1 arc-90 51.42,6.5 D11.A 48.2,9.3 arc90 48,9.5
  Bottom 1.5: Q1.C 88.5,21.5
  Bottom 2: 88.5,21.5 93.93,16.07 93.93,9.2 arc-90 91.39,6.66 RL1.A1
R  (via drill 0.51 pad 1, 0.8 pad 1.6)
  Top 0.61: 10.5,78.6 R5.2
  Top 1: v10.5,82 10.5,78.6
  Bottom 1: v5.5,2 5.5,2.07 1.5,6 1.5,73.1 9.5,80.99 9.5,81 v10.5,82 18.15,89.65 59,89.65 60.5,88.15 TR1.2
R_LED  (via drill 0.51 pad 1)
  Top 0.305: 66.75,47.5 66.75,46.54 68.58,44.72 U2.26
  Top 0.61: v65,53 65,52.36 66.75,50.6 66.75,47.5
  Bottom 0.61: v65,53 65,54 61.52,57.48 53.8,57.48 52.68,56.36 38.82,56.36 38.68,56.5 | LED7.A 35.92,66.35 35.92,61.44 38.68,58.68 38.68,56.5 | 38.68,56.5 38.68,52 36.68,50 LED4.A
RA  (via drill 0.51)
  Top 0.305: 73.32,31.5 73.32,32.58 72.47,33.42 U2.9
  Top 0.61: 13.5,33.5 R22.1 | 73.32,31.5 73.32,21.5 70.74,18.92 21.18,18.92 CT3.2 | 13.5,33.5 13.5,36.45 D6.C D5.A | v17,32.5 14.5,32.5 13.5,33.5
  Bottom 0.61: v17,32.5 CT3.2
RELAY  (via drill 0.51 pad 1)
  Top 0.305: 77.93,47.5 77.93,47.17 75.13,44.37 75.08,44.31 U2.16
  Top 0.61: v91.5,37.5 89,35 R33.2 | 77.93,47.5 77.93,48.03 82.9,53 89,53 91.5,50.5 v91.5,42.5
  Bottom 0.61: v91.5,37.5 v91.5,42.5
RST
  Top 0.305: 75.69,47.5 75.69,46.73 73.78,44.81 U2.18
  Top 0.61: C13.2 R34.2 70.6,67.6 71.5,68.5 83,68.5 84.33,67.17 84.33,57.59 75.69,48.95 75.69,47.5
RV
  Top 0.305: 76.68,31.5 76.68,31.92 74.42,34.17 U2.12
  Top 0.61: R12.1 R15.2 R16.1 4.5,61.5 1.5,58.5 1.5,22.92 3.62,20.87 12.53,20.87 17.83,15.56 72.67,15.56 76.68,19.56 76.68,31.5
S_LED
  Top 0.305: 67.73,31.5 67.73,32.23 69.22,33.73 U2.4
  Top 0.61: R2.1 42,27 44.09,24.91 49.59,24.91 52.23,22.27 64.43,22.27 67.73,25.57 67.73,31.5
SCF  (via drill 0.51)
  Top 0.305: 71.09,31.5 71.09,32.91 71.17,33 U2.7
  Top 0.61: 71.09,31.5 71.09,24 68.5,21.41 v68.5,21 | v23.5,24.5 21.1,26.9 R23.2 R24.2
  Bottom 0.61: v68.5,21 27,21 v23.5,24.5
STOP  (1 unrouted)
  Top 0.305: 66.62,31.5 66.62,32.12 68.58,34.08 U2.3
  Top 0.61: SW2.P$4 54.15,23.39 63.97,23.39 66.62,26.04 66.62,31.5
UPDI
  Top 0.305: 74.58,47.5 74.58,46.51 73.12,45.06 U2.19
  Top 0.61: 74.58,47.5 74.58,49.42 82.42,57.26 J1.1
V_DIS  (via drill 0.51 pad 1)
  Top 0.305: 68.99,47.5 68.99,46.1 69.88,45.22 U2.24
  Top 0.61: IC2.3 49.91,47 50.06,46.85 50.06,45.51 52.06,43.5 v60.5,43.5 | R26.1 68,54 68.99,53.01 | 68.99,53.01 68.99,47.5 | v69,53 68.99,53.01
  Bottom 0.61: v69,53 69,51.5 61,43.5 v60.5,43.5
V_SCK  (via drill 0.51 pad 1)
  Top 0.305: 67.87,47.5 67.87,46.32 69.22,44.97 U2.25
  Top 0.61: v60.5,45.5 60,45 52.15,45 51.17,45.97 IC2.2 | R28.1 64.5,55.5 v67,53 67,52.94 67.87,52.07 67.87,47.5
  Bottom 0.61: v67,53 67,52 v60.5,45.5
VCC  (via drill 0.51 pad 1)
  Top 0.305: 73.46,47.5 73.46,46.29 72.47,45.31 U2.20 72.47,38.12 72.5,38.1 | U2.14 75.72,37.88
  Top 0.61: 73.46,47.5 73.46,49.88 79.88,56.3 J1.2 79.88,66.12 79,67 76,67 75,66 R34.1 | R26.2 R27.2 R29.2 | R26.2 R28.2 | IC2.10 44.83,43.17 44.4,43.6 C11.2 39.88,43.6 C9.+ | IC3.10 44.83,61.17 44.4,61.6 C12.2 39.88,61.6 C10.+ | 75.72,37.88 75.5,38.1 | v68,65.5 R26.2
  Top 1: C9.+ 37.5,41.22 37.5,38.5 39.09,36.91 58.5,36.91 59.31,37.72 C5.+ 62.38,38.1 C15.2 72.5,38.1 75.5,38.1 C14.2 83.6,38.1 84.5,39 84.5,40.5 84.5,45.92 IC1.OUT
  Top 1.016: C4.+ 84.5,40.5
  Bottom 0.61: v68,65.5 69,66.5 78.98,66.5 79.88,65.6 J1.2
  Bottom 0.813: C10.+ 37.28,63.44 37.28,68.5 35.64,70.14 31,70.14 29.5,68.64 29.5,60.5 28,59 28,45.91 30.69,43.22 C9.+
VEE
  Top 0.762: 51.5,89 53.03,90.53 53.5,90.53
  Top 0.813: D9.C 80.7,86.3 80.27,86.73 X1.2 80.27,90 79.74,90.53 53.5,90.53 | R25.1 51.5,89
  Top 1.016: 93.7,40.5 arc90 93.9,40.7 | D9.C 81.7,83 90.5,83 91.78,81.72 C2.+
  Top 1.5: 93.9,40.7 93.7,40.5 C3.+ 89.54,40.73 IC1.IN
  Top 2: 93.93,40.73 93.7,40.5 | 93.93,40.73 93.93,61.07 91.78,63.22 C1.+ 91.78,76.5 | 93.93,40.73 93.93,5.54 arc-90 91.89,3.5 79.02,3.5 arc-90 76.97,5.54 D12.C arc90 76.81,6.66 RL1.A2 58.16,6.66 arc90 57.85,6.35 55,3.5 47.34,3.5 arc-90 44.8,6.04 D11.C arc90 44.64,6.66 RL2.A2 24.16,6.66 arc90 23.85,6.35 21,3.5 14.02,3.5 arc-90 11.97,5.54 D10.C arc90 11.81,6.66 RL3.A2 | C2.+ 91.78,76.5 | 91.78,76.5 84.5,76.5 80.7,72.7 B1.+
Y  (via drill 0.51 pad 1, 0.8 pad 1.6)
  Top 1: v17.5,83 17.5,78.6 R6.2
  Bottom 1: v37.5,2 28.06,11.44 5.86,11.44 4,13.3 4,69.5 v17.5,83
Y_LED  (via drill 0.51 pad 1)
  Top 0.305: 65.64,47.5 65.64,46.76 67.92,44.47 U2.27
  Top 0.61: 65.64,47.5 65.64,49.64 63.5,51.78 v63.5,52
  Bottom 0.61: LED8.A 29.5,58.23 29.5,48.5 30.5,47.5 34.5,47.5 | 34.5,47.5 36.27,47.5 41.62,52.85 56.65,52.85 58.07,51.43 62.93,51.43 v63.5,52 | LED5.A 34.27,47.27 34.5,47.5
YA  (via drill 0.51, 0.51 pad 1)
  Top 0.305: 72.21,31.5 72.21,32.79 71.83,33.17 U2.8
  Top 0.61: 72.21,31.5 72.21,23.21 v70.5,21.5 | D3.A D4.C 13.4,43.35 R21.1 v17,40.5
  Bottom 0.61: v70.5,21.5 70.36,21.5 68.93,22.93 48.17,22.93 | v17,40.5 34.57,22.93 48.17,22.93 | 48.17,22.93 CT2.2
YV
  Top 0.305: 75.56,31.5 75.56,32.14 73.78,33.92 U2.11
  Top 0.61: R13.1 R17.1 R18.1 14.6,59 14.1,58.5 5.5,58.5 3,56 3,23.5 4.51,21.99 12.99,21.99 18.29,16.68 72.06,16.68 75.56,20.18 75.56,31.5

### Text on the board
Reference: BT AQ DOL R8